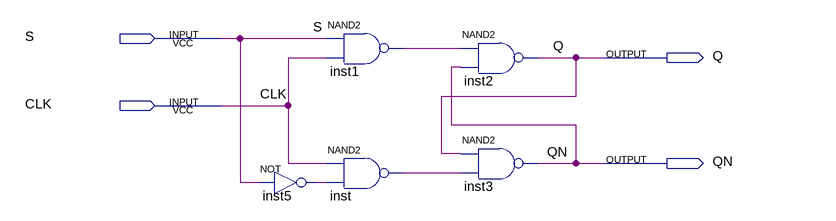
[diagram p0: schematic sheet]
// Quartus schematic d_latch.bdf as structural Verilog: 5 symbols, 4 pins
module d_latch (
  input  S,
  input  CLK,
  output Q,
  output QN
);

  wire inst1_out, inst5_out, inst_out;

  nand inst1 (inst1_out, S, CLK);
  nand inst (inst_out, CLK, inst5_out);
  not inst5 (inst5_out, S);
  nand inst2 (Q, inst1_out, QN);
  nand inst3 (QN, Q, inst_out);
endmodule
